# EAGLE design Eagle_Lecture (EAGLE 8.1.1)
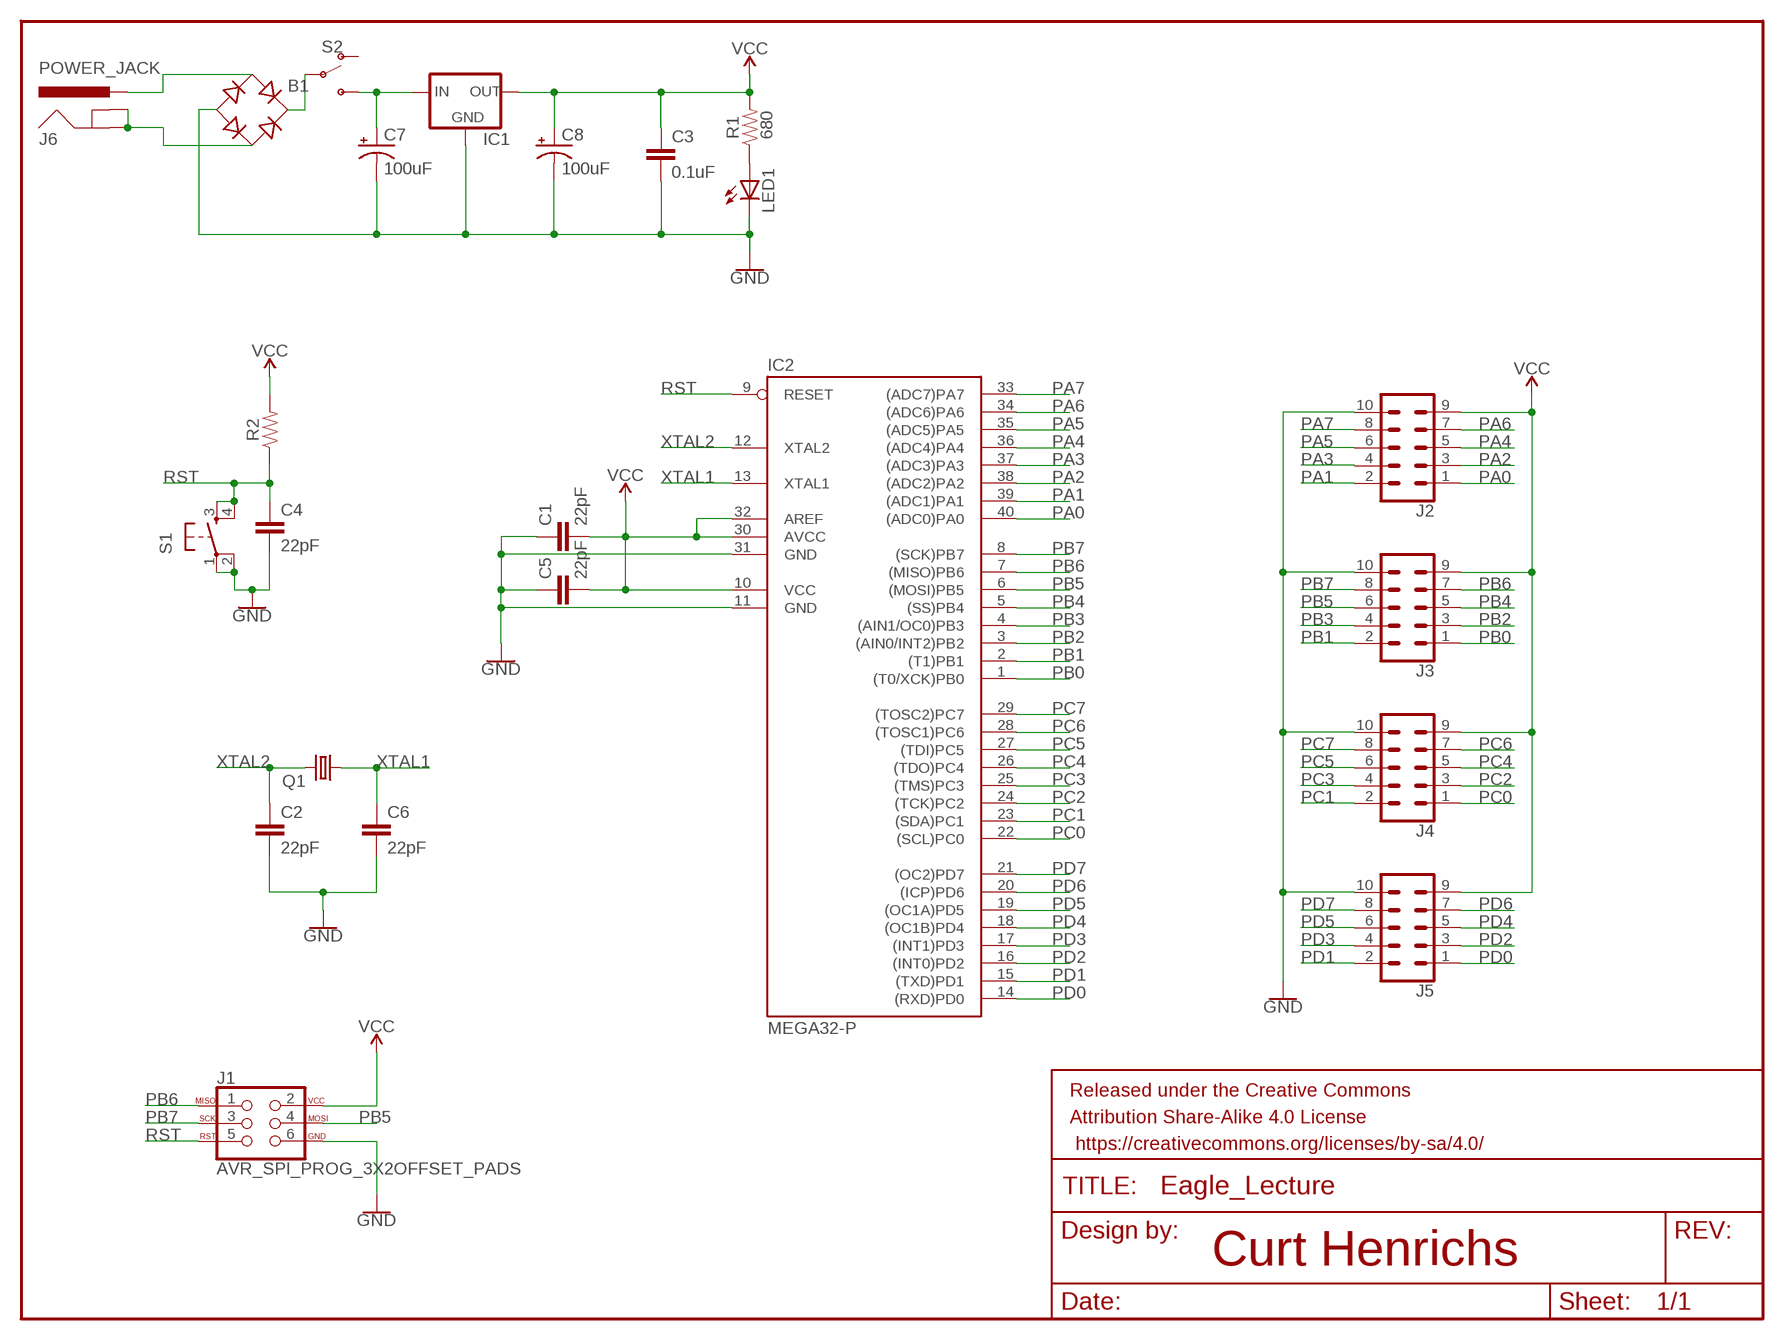
[diagram p0: schematic, sheet 1]

## Parts
B1  B-DIL  [B-DIL]
C1  22pF  22PF-PTH-2.54MM-200V-5%  [CAP-PTH-2.54]
C2  22pF  22PF-PTH-2.54MM-200V-5%  [CAP-PTH-2.54]
C3  0.1uF  22PF-PTH-2.54MM-200V-5%  [CAP-PTH-2.54]
C4  22pF  22PF-PTH-2.54MM-200V-5%  [CAP-PTH-2.54]
C5  22pF  22PF-PTH-2.54MM-200V-5%  [CAP-PTH-2.54]
C6  22pF  22PF-PTH-2.54MM-200V-5%  [CAP-PTH-2.54]
C7  100uF  100UF-POLAR-RADIAL-2.5MM-25V-20%  [CPOL-RADIAL-2.5MM-6.5MM]
C8  100uF  100UF-POLAR-RADIAL-2.5MM-25V-20%  [CPOL-RADIAL-2.5MM-6.5MM]
FRAME1  FRAME-LETTER  [CREATIVE_COMMONS]
IC1  78MXXL  [78MXXL]
IC2  MEGA32-P  [DIL40]
J1  AVR_SPI_PROG_3X2OFFSET_PADS  [2X3_OFFSET]
J2  CONN_05X2SHD  [2X5-SHROUDED]
J3  CONN_05X2SHD  [2X5-SHROUDED]
J4  CONN_05X2SHD  [2X5-SHROUDED]
J5  CONN_05X2SHD  [2X5-SHROUDED]
J6  POWER_JACK  [POWER_JACK_PTH]
LED1  LED3MM  [LED3MM]
Q1  CRYSTALHC49U-V  [HC49U-V]
R1  680  RESISTORAXIAL-0.3  [AXIAL-0.3]
R2  RESISTORAXIAL-0.3  [AXIAL-0.3]
S1  TAC_SWITCHPTH  [TACTILE-PTH]
S2  SWITCH-SPDT-PTH-11.6X4.0MM  [SWITCH_SPDT_PTH_11.6X4.0MM]

## Nets
GND: B1.- C1.1 C2.2 C3.2 C4.2 C5.1 C6.2 C7.2(-) C8.2(-) IC1.GND IC2.11(GND) IC2.31(GND) J1.6 J2.10 J3.10 J4.10 J5.10 LED1.K(C) S1.1 S1.2
N$1: B1.AC2 J6.GND J6.GNDBREAK
N$2: B1.AC1 J6.PWR
N$76: B1.+ S2.2(P)
N$77: C7.1(+) IC1.IN S2.3(S)
N$79: LED1.A R1.P$1
PA0: IC2.40((ADC0)PA0) J2.1
PA1: IC2.39((ADC1)PA1) J2.2
PA2: IC2.38((ADC2)PA2) J2.3
PA3: IC2.37((ADC3)PA3) J2.4
PA4: IC2.36((ADC4)PA4) J2.5
PA5: IC2.35((ADC5)PA5) J2.6
PA6: IC2.34((ADC6)PA6) J2.7
PA7: IC2.33((ADC7)PA7) J2.8
PB0: IC2.1((T0/XCK)PB0) J3.1
PB1: IC2.2((T1)PB1) J3.2
PB2: IC2.3((AIN0/INT2)PB2) J3.3
PB3: IC2.4((AIN1/OC0)PB3) J3.4
PB4: IC2.5((SS)PB4) J3.5
PB5: IC2.6((MOSI)PB5) J1.4 J3.6
PB6: IC2.7((MISO)PB6) J1.1 J3.7
PB7: IC2.8((SCK)PB7) J1.3 J3.8
PC0: IC2.22((SCL)PC0) J4.1
PC1: IC2.23((SDA)PC1) J4.2
PC2: IC2.24((TCK)PC2) J4.3
PC3: IC2.25((TMS)PC3) J4.4
PC4: IC2.26((TDO)PC4) J4.5
PC5: IC2.27((TDI)PC5) J4.6
PC6: IC2.28((TOSC1)PC6) J4.7
PC7: IC2.29((TOSC2)PC7) J4.8
PD0: IC2.14((RXD)PD0) J5.1
PD1: IC2.15((TXD)PD1) J5.2
PD2: IC2.16((INT0)PD2) J5.3
PD3: IC2.17((INT1)PD3) J5.4
PD4: IC2.18((OC1B)PD4) J5.5
PD5: IC2.19((OC1A)PD5) J5.6
PD6: IC2.20((ICP)PD6) J5.7
PD7: IC2.21((OC2)PD7) J5.8
RST: C4.1 IC2.9(RESET) J1.5 R2.P$1 S1.3 S1.4
VCC: C1.2 C3.1 C5.2 C8.1(+) IC1.OUT IC2.10(VCC) IC2.30(AVCC) IC2.32(AREF) J1.2 J2.9 J3.9 J4.9 J5.9 R1.P$2 R2.P$2
XTAL1: C6.1 IC2.13(XTAL1) Q1.1
XTAL2: C2.1 IC2.12(XTAL2) Q1.2
Unconnected: S2.1(O)

## Notes on the sheet
- Curt Henrichs

## Library data of the parts
B1 = rectifier:B-DIL: RECTIFIER
C1 C2 C4-C6 = SparkFun-Capacitors:22PF: 22pF ceramic capacitors A capacitor is a passive two-terminal electrical component used to store electrical energy temporarily in an electric field.; PROD_ID: CAP-09128
C3 = SparkFun-Capacitors:22PF: 22pF ceramic capacitors A capacitor is a passive two-terminal electrical component used to store electrical energy temporarily in an electric field.; PROD_ID: CAP-09128; VALUE: 22pF
C7 C8 = SparkFun-Capacitors:100UF-POLAR: 100µF polarized capacitors A capacitor is a passive two-terminal electrical component used to store electrical energy temporarily in an electric field.; PROD_ID: CAP-08439
FRAME1 = SparkFun-Aesthetics:FRAME-LETTER: Schematic Frame - Letter Standard 8.5x11 US Letter frame
IC1 = v-reg:78MXXL: VOLTAGE REGULATOR
IC2 = atmel:MEGA32-P: MICROCONTROLLER 32 Kbytes FLASH 2 Kbytes SRAM 1 Kbytes EEPROM USART 8-channel 10 bit ADC Source: www.atmel.com .. doc2503.pdf; MPN: ATMEGA32-16PU; OC_FARNELL: 1661729; OC_NEWARK: 51P1794
J1 = SparkFun-Connectors:AVR_SPI_PROG_3X2: AVR ISP 6 Pin This is the reduced ISP connector for AVR programming. Common on Arduino. This footprint will take up less PCB space and can be used with a 10-pin to 6-pin adapter such as SKU: BOB-08508 **Special note about "TEST_POINT" package. The stop mask is on the top side, so if you want your programming test points to be on the bottom of your board, make sure to place this package on the bottom side of the board. This also ensure that the orientation to program from the bottom side will be correct. SparkFun Products: SparkFun ISP Pogo Adapter <https://www.sparkfun.com/products/11591> - NS Tiny AVR Programmer <https://www.sparkfun.com/products/11801> -PTH
J2-J5 = SparkFun-Connectors:CONN_05X2: Multi connection point. Often used as Generic Header-pin footprint for 0.1 inch spaced/style header connections For AVR SPI programming port, see special device with nice symbol: "AVR_SPI_PROG_5x2.dev" You can populate with any combo of single row headers, but if you'd like an exact match, check these: 2x5 AVR ICSP Male Header <https://www.sparkfun.com/products/778> (PRT-00778) 2x5 Pin Shrouded Header <https://www.sparkfun.com/products/8506> (PRT-08506) On any of the 0.1 inch spaced packages, you can populate with these: Break Away Headers - Straight <https://www.sparkfun.com/products/116> (PRT-00116) Break Away Male Headers - Right Angle <https://www.sparkfun.com/products/553> (PRT-00553) Female Headers <https://www.sparkfun.com/products/115> (PRT-00115) Break Away Headers - Machine Pin <https://www.sparkfun.com/products/117> (PRT-00117) Break Away Female Headers - Swiss Machine Pin <https://www.sparkfun.com/products/743> (PRT-00743) Special note: the shrouded connector mates well with our 5x2 ribbon cables: 2x5 Pin IDC Ribbon Cable <https://www.sparkfun.com/products/8535> (PRT-08535); PROD_ID: CONN-08671; SF_ID: PRT-08506
J6 = SparkFun-Connectors:POWER_JACK: Power Jack Connector This is the standard 5.5mm barrel jack for power. The PTH is the most common, proven, reliable, footprint. The Slot footprint only works if the mill layer is transmitted to the PCB fab house so be warned. Here are the connectors we sell at SparkFun: DC Barrel Power Jack/Connector <https://www.sparkfun.com/products/119> (PRT-00119) DC Barrel Power Jack/Connector (SMD) <https://www.sparkfun.com/products/12748> (PRT-12748) DC Barrel Jack Adapter - Breadboard Compatible <https://www.sparkfun.com/products/10811> (PRT-10811) It is used on this SparkFun product (and many, many others): SparkFun RedBoard - Programmed with Arduino <https://www.sparkfun.com/products/12757> (DEV-12757) Also, if you need a mating power supply or connector, please check these out: Wall Adapter Power Supply - 9VDC 650mA <https://www.sparkfun.com/products/298> (TOL-00298) DC Barrel Jack Adapter - Male <https://www.sparkfun.com/products/10287> (PRT-10287); PROD_ID: CONN-08197
LED1 = led:LED: LED OSRAM: - CHIPLED LG R971, LG N971, LY N971, LG Q971, LY Q971, LO R971, LY R971 LH N974, LH R974 LS Q976, LO Q976, LY Q976 LO Q996 - Hyper CHIPLED LW Q18S LB Q993, LB Q99A, LB R99A - SideLED LS A670, LO A670, LY A670, LG A670, LP A670 LB A673, LV A673, LT A673, LW A673 LH A674 LY A675 LS A676, LA A676, LO A676, LY A676, LW A676 LS A679, LY A679, LG A679 - Hyper Micro SIDELED® LS Y876, LA Y876, LO Y876, LY Y876 LT Y87S - SmartLED LW L88C, LW L88S LB L89C, LB L89S, LG L890 LS L89K, LO L89K, LY L89K LS L896, LA L896, LO L896, LY L896 - TOPLED LS T670, LO T670, LY T670, LG T670, LP T670 LSG T670, LSP T670, LSY T670, LOP T670, LYG T670 LG T671, LOG T671, LSG T671 LB T673, LV T673, LT T673, LW T673 LH T674 LS T676, LA T676, LO T676, LY T676, LB T676, LH T676, LSB T676, LW T676 LB T67C, LV T67C, LT T67C, LS T67K, LO T67K, LY T67K, LW E67C LS E67B, LA E67B, LO E67B, LY E67B, LB E67C, LV E67C, LT E67C LW T67C LS T679, LY T679, LG T679 LS T770, LO T770, LY T770, LG T770, LP T770 LB T773, LV T773, LT T773, LW T773 LH T774 LS E675, LA E675, LY E675, LS T675 LS T776, LA T776, LO T776, LY T776, LB T776 LHGB T686 LT T68C, LB T68C - Hyper Mini TOPLED® LB M676 - Mini TOPLED Santana® LG M470 LS M47K, LO M47K, LY M47K Source: http://www.osram.convergy.de LUXEON: - LUMILED® LXK2-PW12-R00, LXK2-PW12-S00, LXK2-PW14-U00, LXK2-PW14-V00 LXK2-PM12-R00, LXK2-PM12-S00, LXK2-PM14-U00 LXK2-PE12-Q00, LXK2-PE12-R00, LXK2-PE12-S00, LXK2-PE14-T00, LXK2-PE14-U00 LXK2-PB12-K00, LXK2-PB12-L00, LXK2-PB12-M00, LXK2-PB14-N00, LXK2-PB14-P00, LXK2-PB14-Q00 LXK2-PR12-L00, LXK2-PR12-M00, LXK2-PR14-Q00, LXK2-PR14-R00 LXK2-PD12-Q00, LXK2-PD12-R00, LXK2-PD12-S00 LXK2-PH12-R00, LXK2-PH12-S00 LXK2-PL12-P00, LXK2-PL12-Q00, LXK2-PL12-R00 Source: www.luxeon.com KINGBRIGHT: KA-3528ASYC Source: www.kingbright.com
Q1 = crystal:CRYSTAL: CRYSTAL; OC_FARNELL: 1666969; OC_NEWARK: unknown
R1 R2 = SparkFun-Resistors:RESISTOR: Generic Resistor Package
S1 = SparkFun-Retired:TAC_SWITCH: Momentary Switch Button commonly used for reset or general input. Spark Fun Electronics SKU : COM-00097 SMT- SWCH-08247
S2 = SparkFun-Switches:SWITCH-SPDT: Single Pole, Double Throw (SPDT) Switch Single-pole, double-throw (SPDT) switch. Variant Overview SMD-AYZ0202 Surface Mount DPDT Switch <https://www.sparkfun.com/products/597> (COM-00597) Used on e.g. LilyPad Arduino USB - ATmega32U4 Board <https://www.sparkfun.com/products/12049> PTH-11.6X4.0MM SPDT Mini Power Switch <https://www.sparkfun.com/products/102> (COM-00102) Used on e.g. SparkFun Simon Says - Through-Hole Soldering Kit <https://www.sparkfun.com/products/10547> (KIT-10547) PTH-11.6X4.0MM-KIT KIT version of SPDT Mini Power Switch - Simplifies soldering by removing tStop of switch pins - only one side can be soldered. PTH-11.6X4.0MM-LOCK LOCK version of SPDT Mini Power Switch - Offset pins hold switch in place for easier soldering. SMD-RIGHT-ANGLE Surface Mount Right Angle Switch <https://www.sparkfun.com/products/10860> (COM-10860) Used on e.g. SparkFun ESP8266 Thing <https://www.sparkfun.com/products/13231>; PROD_ID: SWCH-08261; SF_SKU: COM-00102

## Board
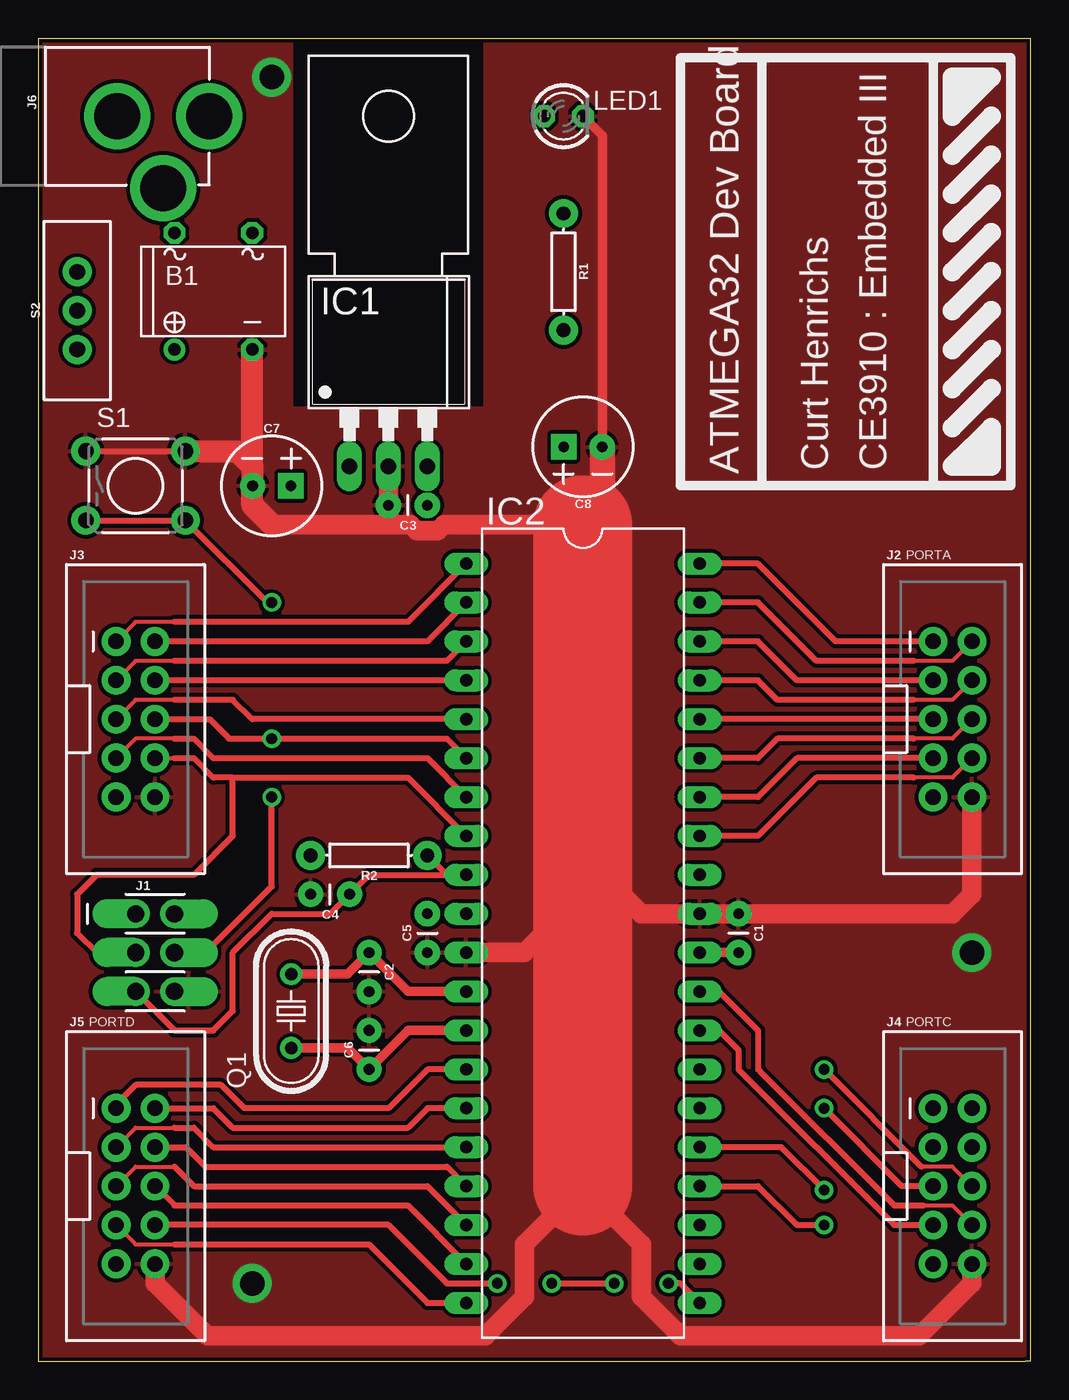
[diagram p1: board, top side]
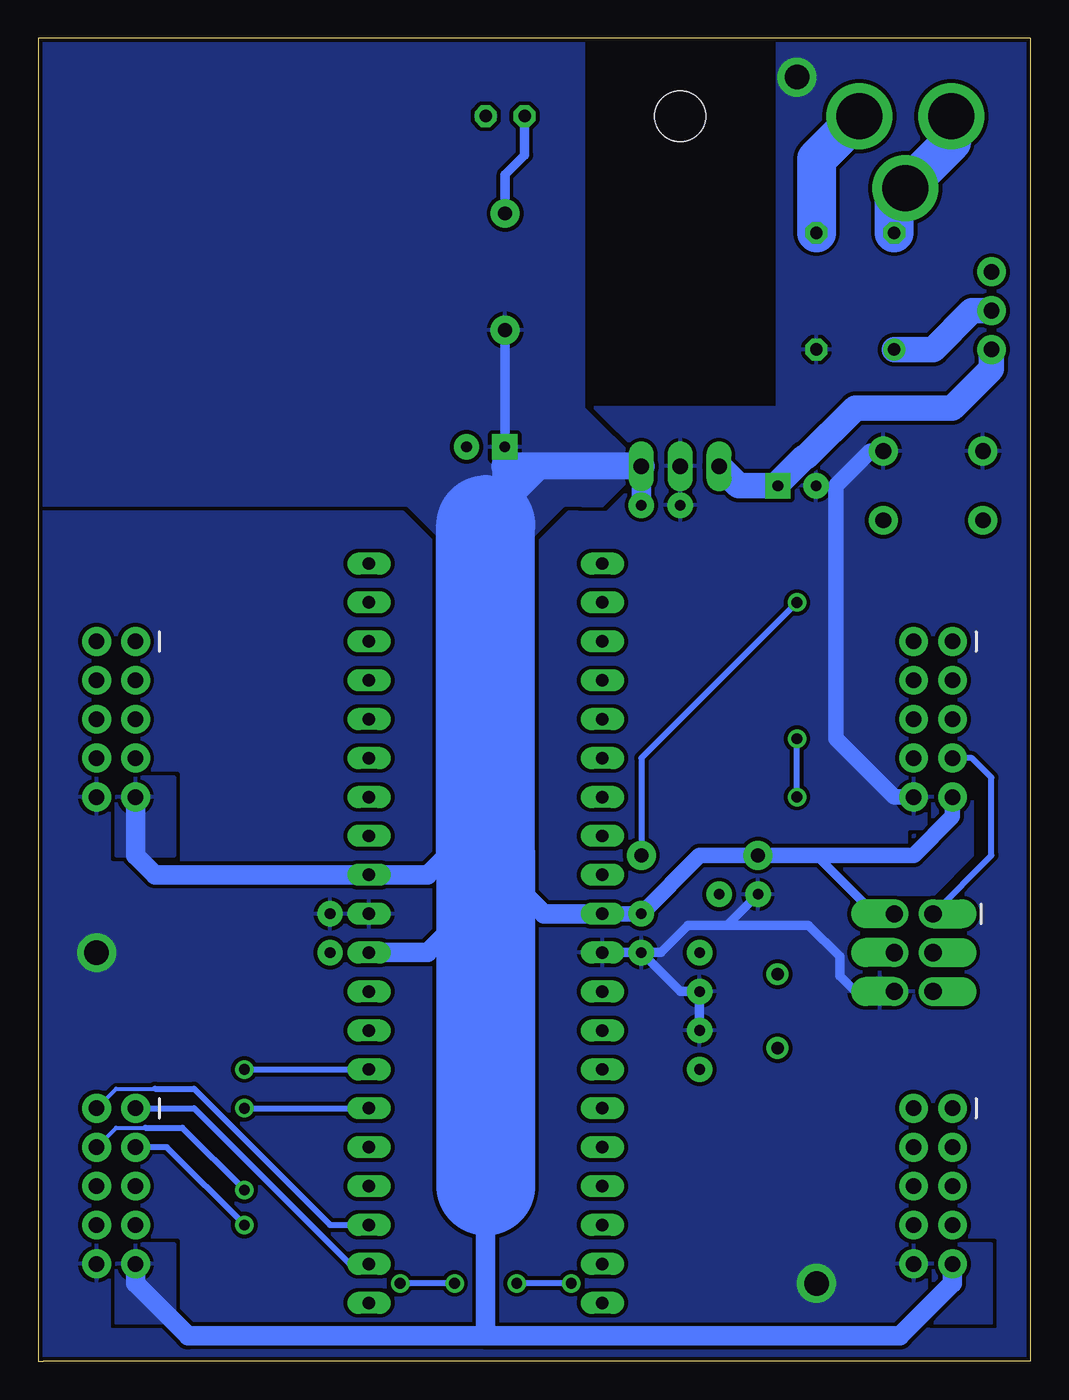
[diagram p2: board, bottom side, seen from below]

Size 64.77 x 86.36 mm. Coordinates in mm from the lower left corner, seen from the top.
Outline: 0,86.35 0,0 64.44,0 64.77,0 64.77,86.36 0,86.36
Copper layers (1*16): Top 0.035mm / dielectric 1.5mm / Bottom 0.035mm
Design rules "SparkFun": minimum track width 8mil, minimum drill 20mil, track to track 8mil, track to pad 8mil, pad to pad 8mil, via to via 8mil, smd to smd 8mil, copper to edge 8mil, drill to drill 8mil, minimum pad ring 12mil, minimum via ring 10mil, stop-mask expansion 4mil, vias tented up to drill 20mil, thermal gap 10mil

### Footprints (pad centres in the part's own frame; a part is rotated, then mirrored left to right if it is on the bottom)
B-DIL = drill 0.813: + -2.54,-3.81 | drill 0.813 octagon: - 2.54,-3.81; AC1 2.54,3.81; AC2 -2.54,3.81
CAP-PTH-2.54 = drill 0.7 pad 1.651: 1 -1.27,0; 2 1.27,0
CPOL-RADIAL-2.5MM-6.5MM = drill 0.7 pad 1.651 square: 1 1.25,0 | drill 0.7 pad 1.651: 2 -1.25,0
78MXXL = drill 1.016 long: GND 0,-5.08; IN -2.54,-5.08; OUT 2.54,-5.08 | hole 3.302: 0,17.78
DIL40 = drill 0.813 long: 1 -24.13,-7.62; 2 -21.59,-7.62; 3 -19.05,-7.62; 4 -16.51,-7.62; 5 -13.97,-7.62; 6 -11.43,-7.62; 7 -8.89,-7.62; 8 -6.35,-7.62; 9 -3.81,-7.62; 10 -1.27,-7.62; 11 1.27,-7.62; 12 3.81,-7.62; 13 6.35,-7.62; 14 8.89,-7.62; 15 11.43,-7.62; 16 13.97,-7.62; 17 16.51,-7.62; 18 19.05,-7.62; 19 21.59,-7.62; 20 24.13,-7.62; 21 24.13,7.62; 22 21.59,7.62; 23 19.05,7.62; 24 16.51,7.62; 25 13.97,7.62; 26 11.43,7.62; 27 8.89,7.62; 28 6.35,7.62; 29 3.81,7.62; 30 1.27,7.62; 31 -1.27,7.62; 32 -3.81,7.62; 33 -6.35,7.62; 34 -8.89,7.62; 35 -11.43,7.62; 36 -13.97,7.62; 37 -16.51,7.62; 38 -19.05,7.62; 39 -21.59,7.62; 40 -24.13,7.62
2X3_OFFSET = drill 1.118 pad 1.88 offset: 1 -2.54,-1.27; 2 -2.54,1.27; 3 0,-1.27; 4 0,1.27; 5 2.54,-1.27; 6 2.54,1.27
2X5-SHROUDED = drill 1.016 pad 1.88: 1 -1.27,5.08; 2 1.27,5.08; 3 -1.27,2.54; 4 1.27,2.54; 5 -1.27,0; 6 1.27,0; 7 -1.27,-2.54; 8 1.27,-2.54; 9 -1.27,-5.08; 10 1.27,-5.08
POWER_JACK_PTH = drill 2.997 pad 4.318: GND 0,7.7; GNDBREAK 4.7,10.7; PWR 0,13.7
LED3MM = drill 0.813 octagon: A -1.27,0; K 1.27,0
HC49U-V = drill 0.813: 1 -2.413,0; 2 2.413,0
AXIAL-0.3 = drill 0.9 pad 1.88: P$1 -3.81,0; P$2 3.81,0
TACTILE-PTH = drill 1.016 pad 1.88: 1 -3.251,2.261; 2 3.251,2.261; 3 -3.251,-2.261; 4 3.251,-2.261
SWITCH_SPDT_PTH_11.6X4.0MM = drill 1.016 pad 1.88: 1 0,2.54; 2 0,0; 3 0,-2.54

### Placement (x,y rotation side)
B1  11.43,69.85 0 top
C1  45.72,27.94 270 top
C2  21.59,25.4 270 top
C3  24.13,55.88 180 top
C4  19.05,30.48 180 top
C5  25.4,27.94 90 top
C6  21.59,20.32 90 top
C7  15.24,57.15 0 top
C8  35.56,59.69 180 top
FRAME1  0,-10.16 0 top  (outside the outline)
IC1  22.86,63.5 0 top
IC2  35.56,27.94 270 top
J1  7.62,26.67 270 top
J2  59.69,41.91 0 top
J3  6.35,41.91 0 top
J4  59.69,11.43 0 top
J5  6.35,11.43 0 top
J6  -2.54,81.28 270 top
LED1  34.29,81.28 0 top
Q1  16.51,22.86 90 top
R1  34.29,71.12 270 top
R2  21.59,33.02 180 top
S1  6.35,57.15 0 top
S2  2.54,68.58 0 top

### Tracks (layer width: path | path; a pad name or v marks a point on that pad's centre or on a via)
GND  (via drill 1.6 pad 2.54)
  Top 0.406: S1.1 S1.2
  Top 0.61: LED1.K 36.83,80.01 36.83,59.71 C8.2
  Top 1.27: 35.56,30.48 35.56,11.43 | 35.56,33.02 35.56,30.48 | 35.56,54.61 35.56,33.02 | J5.10 7.62,5.08 11.05,1.65 29.21,1.65 31.75,4.19 31.75,7.62 35.56,11.43 | J4.10 60.96,5.08 57.53,1.65 41.91,1.65 39.37,4.19 39.37,7.62 35.56,11.43 | J2.10 60.96,30.48 59.69,29.21 C1.1 IC2.31 39.37,29.21 35.56,33.02 | IC2.11 31.75,26.67 35.56,30.48 | 35.56,54.61 35.56,55.88 36.81,57.13 | 35.09,54.14 35.56,54.61 | 22.86,54.61 24.32,54.61 24.71,54.22 26.09,54.22 26.48,54.61 35.56,54.61 | 22.86,54.61 15.24,54.61 | IC1.GND C3.2 22.86,54.61
  Top 1.422: 13.97,58.42 B1.- | S1.2 12.98,59.41 13.97,58.42 | 13.97,58.42 13.97,57.17 | 13.97,57.17 C7.2 | 15.24,54.61 13.97,55.88 13.97,57.17 | 34.29,55.88 35.56,54.61
  Top 1.676: 34.31,55.9 34.29,55.88 | C8.2 36.83,59.69 36.83,54.61 35.56,54.61
  Top 6.452: 35.56,11.43 35.56,54.61
  Bottom 0.61: C5.1 22.86,24.13 C2.2 C6.2 | C5.1 IC2.11 | C5.1 24.13,26.67 22.35,28.45 19.81,28.45 | J1.6 11.43,24.13 12.45,25.15 12.45,26.42 14.48,28.45 19.81,28.45 | C4.2 19.81,28.45
  Bottom 1.016: J3.10 8.89,36.83 12.7,40.64 12.7,57.15 10.44,59.41 S1.2
  other vias: 60.96,26.67 15.24,83.82 13.97,5.08
  pour Bottom (isolate 0.254, rank 6): 0,86.36 16.51,86.36 16.51,62.23 29.21,62.23 29.21,86.36 64.77,86.36 64.77,0 0,0
  pour Top (isolate 0.254, rank 6): 0,86.36 16.51,86.36 16.51,62.23 29.21,62.23 29.21,86.36 64.77,86.36 64.77,0 0,0
  pour Bottom (isolate 0.813, rank 6): 29.21,62.23 27.94,60.96 15.24,60.96 13.97,62.23
N$1
  Bottom 2.54: B1.AC2 8.89,75.85 J6.GNDBREAK 5.16,79.58 J6.GND
N$2
  Bottom 2.54: J6.PWR 13.97,78.47 B1.AC1
N$3
  pour Bottom (isolate 0.254): 2.54,7.62 5.08,7.62 6.35,6.35 6.35,2.54 2.54,2.54
N$4
  pour Bottom (isolate 0.254): 5.08,38.1 3.81,36.83 3.81,33.02 6.35,30.48 11.43,30.48 13.97,33.02 7.62,33.02 7.62,34.29 6.35,35.56 6.35,36.83
N$76
  Bottom 1.676: S2.2 3.81,68.58 6.35,66.04 B1.+
N$77
  Bottom 1.676: S2.3 2.54,64.77 5.08,62.23 11.43,62.23 14.64,59.02 14.76,59.02 16.49,57.29 C7.1 19.05,57.15 IC1.IN
N$79
  Bottom 0.61: R1.P$1 34.29,77.47 33.02,78.74 LED1.A
PA0
  Top 0.406: IC2.40 46.99,52.07 52.07,46.99 J2.1
PA1
  Top 0.254: J2.2 59.69,45.72 57.15,45.72
  Top 0.406: 57.15,45.72 50.8,45.72 46.99,49.53 IC2.39
PA2
  Top 0.254: 57.15,44.45 J2.3
  Top 0.406: J2.3 49.53,44.45 46.99,46.99 IC2.38
PA3
  Top 0.254: J2.4 59.69,43.18 57.15,43.18
  Top 0.406: 57.15,43.18 48.26,43.18 46.99,44.45 IC2.37
PA4
  Top 0.254: 57.15,41.91 J2.5
  Top 0.406: J2.5 IC2.36
PA5
  Top 0.254: J2.6 59.69,40.64 57.15,40.64
  Top 0.406: 57.15,40.64 48.26,40.64 46.99,39.37 IC2.35
PA6
  Top 0.406: IC2.34 46.99,36.83 49.53,39.37 J2.7
PA7
  Top 0.254: J2.8 59.69,38.1 57.15,38.1
  Top 0.406: 57.15,38.1 50.8,38.1 46.99,34.29 IC2.33
PB0
  Top 0.254: J3.1 6.35,48.26 8.89,48.26
  Top 0.406: IC2.1 24.13,48.26 8.89,48.26
PB1
  Top 0.406: IC2.2 25.4,46.99 J3.2
PB2
  Top 0.254: J3.3 6.35,45.72 8.89,45.72
  Top 0.406: IC2.3 26.67,45.72 8.89,45.72
PB3
  Top 0.406: IC2.4 J3.4
PB4
  Top 0.254: J3.5 6.35,43.18 8.89,43.18
  Top 0.406: IC2.5 13.97,41.91 12.7,43.18 8.89,43.18
PB5  (via drill 0.7 pad 0.81)
  Top 0.406: J3.6 11.18,41.91 12.45,40.64 v15.24,40.64 26.67,40.64 IC2.6 | 10.16,26.67 J1.4 10.92,26.67 15.24,30.99 v15.24,36.83
  Bottom 0.406: v15.24,36.83 v15.24,40.64
PB6
  Top 0.254: J3.7 6.35,40.64 8.89,40.64
  Top 0.406: 8.89,40.64 10.16,40.64 11.43,39.37 25.4,39.37 IC2.7
  Bottom 0.406: J3.7 3.81,39.37 2.54,38.1 2.54,33.02 J1.1
PB7
  Top 0.254: J3.8 8.89,39.37
  Top 0.406: J1.3 3.81,26.67 2.54,27.94 2.54,30.48 3.81,31.75 10.16,31.75 12.7,34.29 12.7,38.1 | IC2.8 24.13,38.1 12.7,38.1 | 8.89,39.37 10.16,39.37 11.43,38.1 12.7,38.1
PC0
  Bottom 0.406: IC2.22 44.45,6.35 54.61,16.51 J4.1
PC1
  Bottom 0.254: J4.2 59.69,17.78 57.15,17.78
  Bottom 0.406: IC2.23 45.72,8.89 54.61,17.78 57.15,17.78
PC2  (via drill 0.7 pad 1.02)
  Top 0.406: IC2.24 46.99,11.43 49.53,8.89 v51.31,8.89
  Bottom 0.406: v51.31,8.89 56.39,13.97 J4.3
PC3  (via drill 0.7 pad 1.02)
  Top 0.406: v51.31,11.18 48.51,13.97 IC2.25
  Bottom 0.254: J4.4 59.69,15.24 57.79,15.24
  Bottom 0.406: 57.79,15.24 55.37,15.24 v51.31,11.18
PC4  (via drill 0.7 pad 1.02)
  Top 0.406: J4.5 56.39,11.43 v51.31,16.51
  Bottom 0.406: v51.31,16.51 IC2.26
PC5  (via drill 0.7 pad 1.02)
  Top 0.254: J4.6 59.69,12.7 57.66,12.7
  Top 0.406: 57.66,12.7 v51.31,19.05
  Bottom 0.406: v51.31,19.05 IC2.27
PC6
  Top 0.406: IC2.28 44.45,21.59 45.72,20.32 45.72,19.05 55.88,8.89 J4.7
PC7
  Top 0.254: J4.8 59.69,10.16 57.79,10.16 | 46.99,19.05 47.12,18.92
  Top 0.406: IC2.29 44.45,24.13 46.99,21.59 46.99,19.05 | 47.12,18.92 55.88,10.16 57.79,10.16
PD0
  Top 0.406: IC2.14 25.4,19.05 22.86,16.51 13.46,16.51 11.94,18.03 6.35,18.03 5.08,16.76 J5.1
PD1
  Top 0.406: IC2.15 25.4,16.51 24.13,15.24 12.7,15.24 11.43,16.51 J5.2
PD2
  Top 0.254: J5.3 6.35,15.24 8.89,15.24
  Top 0.406: 8.89,15.24 10.16,15.24 11.43,13.97 IC2.16
PD3
  Top 0.406: IC2.17 26.67,12.7 10.92,12.7 9.65,13.97 J5.4
PD4
  Top 0.254: J5.5 6.35,12.7 8.89,12.7
  Top 0.406: 8.89,12.7 10.16,11.43 25.4,11.43 IC2.18
PD5
  Top 0.406: J5.6 8.89,10.16 24.13,10.16 IC2.19
PD6
  Top 0.254: J5.7 6.35,7.62 8.89,7.62
  Top 0.406: 8.89,7.62 21.59,7.62 25.4,3.81 IC2.20
PD7  (via drill 0.7 pad 0.81)
  Top 0.406: J5.8 22.86,8.89 26.67,5.08 v29.97,5.08 | IC2.21 41.91,5.08 v41.15,5.08 | v33.53,5.08 v37.59,5.08
  Bottom 0.406: v29.97,5.08 v33.53,5.08 | v37.59,5.08 v41.15,5.08
RST  (via drill 0.7 pad 0.81)
  Top 0.406: J1.5 8.89,21.59 11.43,21.59 12.7,22.86 12.7,26.67 15.24,29.21 19.05,29.21 C4.1 21.59,31.75 IC2.9 26.67,31.75 R2.P$1 | S1.3 S1.4 14.96,49.53 v15.24,49.53
  Bottom 0.406: v15.24,49.53 25.4,39.37 R2.P$1
VCC
  Top 0.61: IC2.30 C1.2
  Bottom 0.61: J1.2 10.16,29.21 13.97,33.02 | R2.P$2 13.97,33.02 | 13.97,33.02 7.62,33.02 | R1.P$2 34.29,59.71 C8.1
  Bottom 1.016: J3.9 5.08,35.56 7.62,33.02 R2.P$2 21.59,33.02 C5.2 IC2.10
  Bottom 1.27: IC2.10 31.75,29.21 35.56,33.02 | J5.9 5.08,5.08 8.51,1.65 35.56,1.65 | J4.9 58.42,5.08 54.99,1.65 35.56,1.65 | 35.56,35.56 39.37,31.75 IC2.32 57.15,31.75 58.42,33.02 J2.9 | 35.56,35.56 35.56,33.02 | 35.56,30.48 35.56,33.02 | 35.56,27.94 35.56,30.48 | 35.56,11.43 35.56,1.65 | 35.56,35.56 35.56,54.61 34.29,55.88 | IC2.30 39.37,26.67 35.56,30.48 | 34.29,55.88 31.75,58.42 | C3.1 IC1.OUT | C8.1 34.31,58.42 34.31,55.9 34.29,55.88
  Bottom 1.422: 35.56,57.15 35.56,55.88 35.56,54.61
  Bottom 1.676: 36.81,55.9 36.83,55.88 35.56,55.88 | C8.1 34.29,59.69 34.29,54.61
  Bottom 1.778: IC1.OUT 34.31,58.42
  Bottom 6.452: 35.56,11.43 35.56,27.94 35.56,33.02 35.56,54.61
  pour Bottom (isolate 0.254): 64.77,86.36 29.21,86.36 29.21,55.88 64.77,55.88
  pour Bottom (isolate 0.254): 57.15,38.1 58.42,38.1 59.69,36.83 59.69,33.02 55.88,33.02 55.88,38.1
  pour Bottom (isolate 0.254): 57.15,7.62 58.42,7.62 59.69,6.35 59.69,2.54 55.88,2.54 55.88,7.62
  pour Bottom (isolate 0.254, rank 4): 25.4,58.42 29.21,62.23 29.21,55.88 27.94,55.88
  pour Bottom (isolate 0.254, rank 4): 38.1,53.34 40.64,55.88 30.48,55.88 33.02,53.34
XTAL1
  Top 0.61: Q1.1 20.19,20.45 C6.1 24.13,21.59 IC2.13 26.67,21.59
XTAL2
  Top 0.61: Q1.2 20.19,25.27 C2.1 24.13,24.13 IC2.12

### Text on the board
tSilk: ATMEGA32 Dev Board | Curt Henrichs | CE3910 : Embedded III | PORTA | PORTD | PORTC